# EAGLE design vusbtinyisp_smt_voltage_reg (EAGLE 6.5.0)
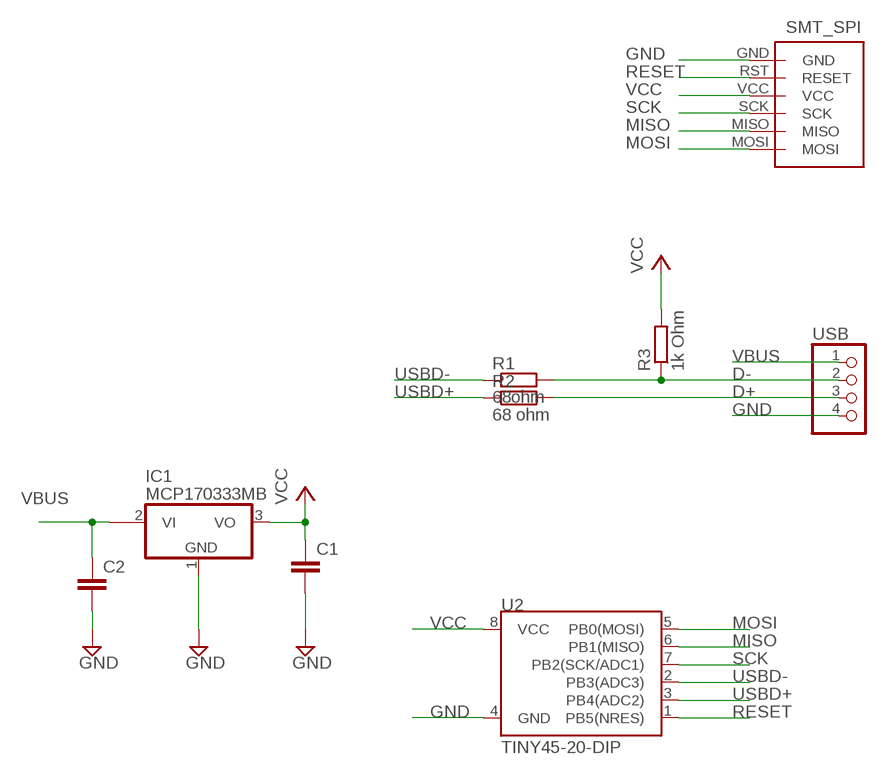
[diagram p0: schematic, sheet 1]

## Parts
C1  CAP1206  [1206]
C2  CAP1206  [1206]
IC1  MCP170333MB  [SOT89]
R1  68ohm  R-EU_R0805  [R0805]
R2  68 ohm  R-EU_R0805  [R0805]
R3  1k Ohm  R-EU_R1206  [R1206]
U2  TINY45-20-DIP  ATTINY45TINY45-20-DIP  [DIP08]
U$1  SMT_ISP  [SMT_PADS]
USB  PINHD-1X4  [1X04]

## Nets
D+: R2.2 USB.3
D-: R1.2 R3.1 USB.2
GND: C1.2 C2.2 IC1.1(GND) U2.4(GND) U$1.GND USB.4
MISO: U2.6(PB1(MISO)) U$1.MISO
MOSI: U2.5(PB0(MOSI)) U$1.MOSI
RESET: U2.1(PB5(NRES)) U$1.RST(RESET)
SCK: U2.7(PB2(SCK/ADC1)) U$1.SCK
USBD+: R2.1 U2.3(PB4(ADC2))
USBD-: R1.1 U2.2(PB3(ADC3))
VBUS: C2.1 IC1.2@1(VI1) USB.1
VCC: C1.1 IC1.3(VO) R3.2 U2.8(VCC) U$1.VCC
Unconnected: IC1.2(VI)

## Library data of the parts
C1 C2 = SparkFun-Passives:CAP: Capacitor Standard 0603 ceramic capacitor, and 0.1" leaded capacitor.
IC1 = linear:MCP1703*: 250 mA, 16V, Low Quiescent Current LDO Regulator Source: http://ww1.microchip.com/downloads/en/DeviceDoc/22049b.pdf
R1-R3 = resistor:R-EU_: RESISTOR, European symbol
U2 = SparkFun-DigitalIC:ATTINY45: Atmel 8-pin 2/4/8kB flash uC; PROD_ID: IC-09439
U$1 = elliot:SMT_ISP
USB = pinhead:PINHD-1X4: PIN HEADER

## Board
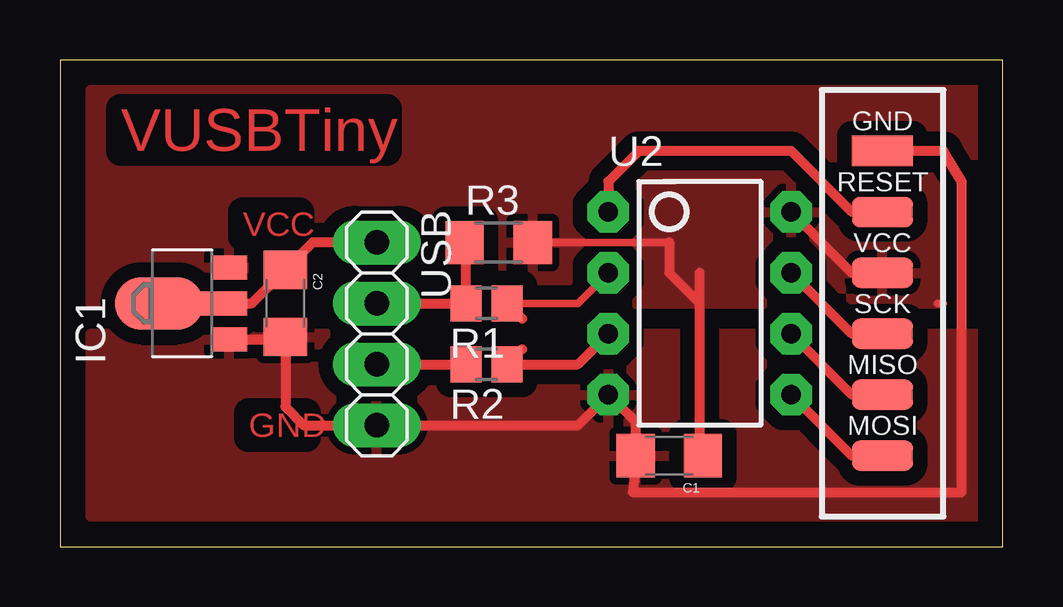
[diagram p1: board, top side]

Size 39.29 x 20.31 mm. Coordinates in mm from the lower left corner, seen from the top.
Outline: 0,0 39.29,0 39.29,20.31 0,20.31 0,0
Copper layers (1*16): Top 0.035mm / dielectric 1.5mm / Bottom 0.035mm
Design rules "improved_12mil": minimum track width 12mil, minimum drill 0.8mm, track to track 12mil, track to pad 12mil, pad to pad 12mil, via to via 12mil, smd to smd 12mil, copper to edge 40mil, drill to drill 12mil, minimum pad ring 16mil, minimum via ring 16mil, stop-mask expansion 4mil, vias tented up to drill 0mil, thermal gap 12mil

### Footprints (pad centres in the part's own frame; a part is rotated, then mirrored left to right if it is on the bottom)
1206 = smd 1.6 x 1.8: 1 -1.4,0; 2 1.4,0
SOT89 = smd 1 x 1.5: 1 -1.499,-1.981; 3 1.499,-1.981 | smd 1 x 2: 2 0,-1.727 | smd 2.2 x 3.7: 2@1 0,0.94
R0805 = smd 1.3 x 1.5: 1 -0.85,0; 2 0.85,0
R1206 = smd 1.6 x 1.803: 1 -1.422,0; 2 1.422,0
DIP08 = drill 0.813 pad 1.727 octagon: 1 -3.81,-3.81; 2 -1.27,-3.81; 3 1.27,-3.81; 4 3.81,-3.81; 5 3.81,3.81; 6 1.27,3.81; 7 -1.27,3.81; 8 -3.81,3.81
SMT_PADS = smd 2.54 x 1.27: GND 0,3.81; MISO 0,-6.35; MOSI 0,-8.89; RST 0,1.27; SCK 0,-3.81; VCC 0,-1.27
1X04 = drill 1.016 long: 1 -3.81,0; 2 -1.27,0; 3 1.27,0; 4 3.81,0

### Placement (x,y rotation side)
C1  25.4,3.81 180 top
C2  9.4,10.16 270 top
IC1  5.08,10.16 90 top
R1  17.78,10.16 180 top
R2  17.78,7.62 180 top
R3  18.29,12.7 0 top
U2  26.67,10.16 270 top
U$1  34.29,12.7 0 top
USB  13.21,8.89 270 top

### Tracks (layer width: path | path; a pad name or v marks a point on that pad's centre or on a via)
D+
  Top 0.406: USB.3 R2.2
D-
  Top 0.406: USB.2 R1.2 16.93,12.64 R3.1
GND
  Top 0.406: USB.4 13.08,5.08 | 24,3.94 23.88,2.29 37.59,2.29 37.59,15.24 36.83,16.51 U$1.GND | C1.2 24,5.21 U2.4 21.59,5.08 USB.4 | IC1.1 9.3,8.66 C2.2 9.4,5.84 10.16,5.08 USB.4
  pour Top (isolate 0.61): 1.27,8.89 1.27,1.27 39.37,1.27 39.37,8.89
MISO
  Top 0.406: U$1.MISO 33.02,6.35 U2.6
MOSI
  Top 0.406: U$1.MOSI 33.02,3.81 U2.5
RESET
  Top 0.406: U$1.RST 33.02,13.97 30.48,16.51 24.13,16.51 22.86,15.24 U2.1
SCK
  Top 0.406: U$1.SCK 33.02,8.89 U2.7
USBD+
  Top 0.406: 19.27,8.26 R2.1 21.59,7.62 U2.3
USBD-
  Top 0.305: R1.1 21.59,10.16 U2.2
  Top 0.406: 19.27,9.52 R1.1
VBUS
  Top 0.406: IC1.2@1 8,10.16 C2.1 10.54,12.7 USB.1
VCC
  Top 0.305: IC1.3 7.62,11.43 7.11,11.71 | 26.67,3.81 C1.1 | 36.83,10.16 36.58,10.16 | R3.2 25.4,12.7
  Top 0.406: U$1.VCC 33.02,11.43 U2.8 | 25.4,12.7 25.4,11.43 26.67,10.16 | 26.67,3.81 26.67,11.43
  pour Top (isolate 0.61): 1.27,19.05 1.27,10.16 39.37,10.16 39.37,19.05

### Text on the board
Top: VUSBTiny | VCC | GND